# Altium project 2.0 - DSP_Expansion_Board_for_28379D_LAUNCHXL.PrjPcb
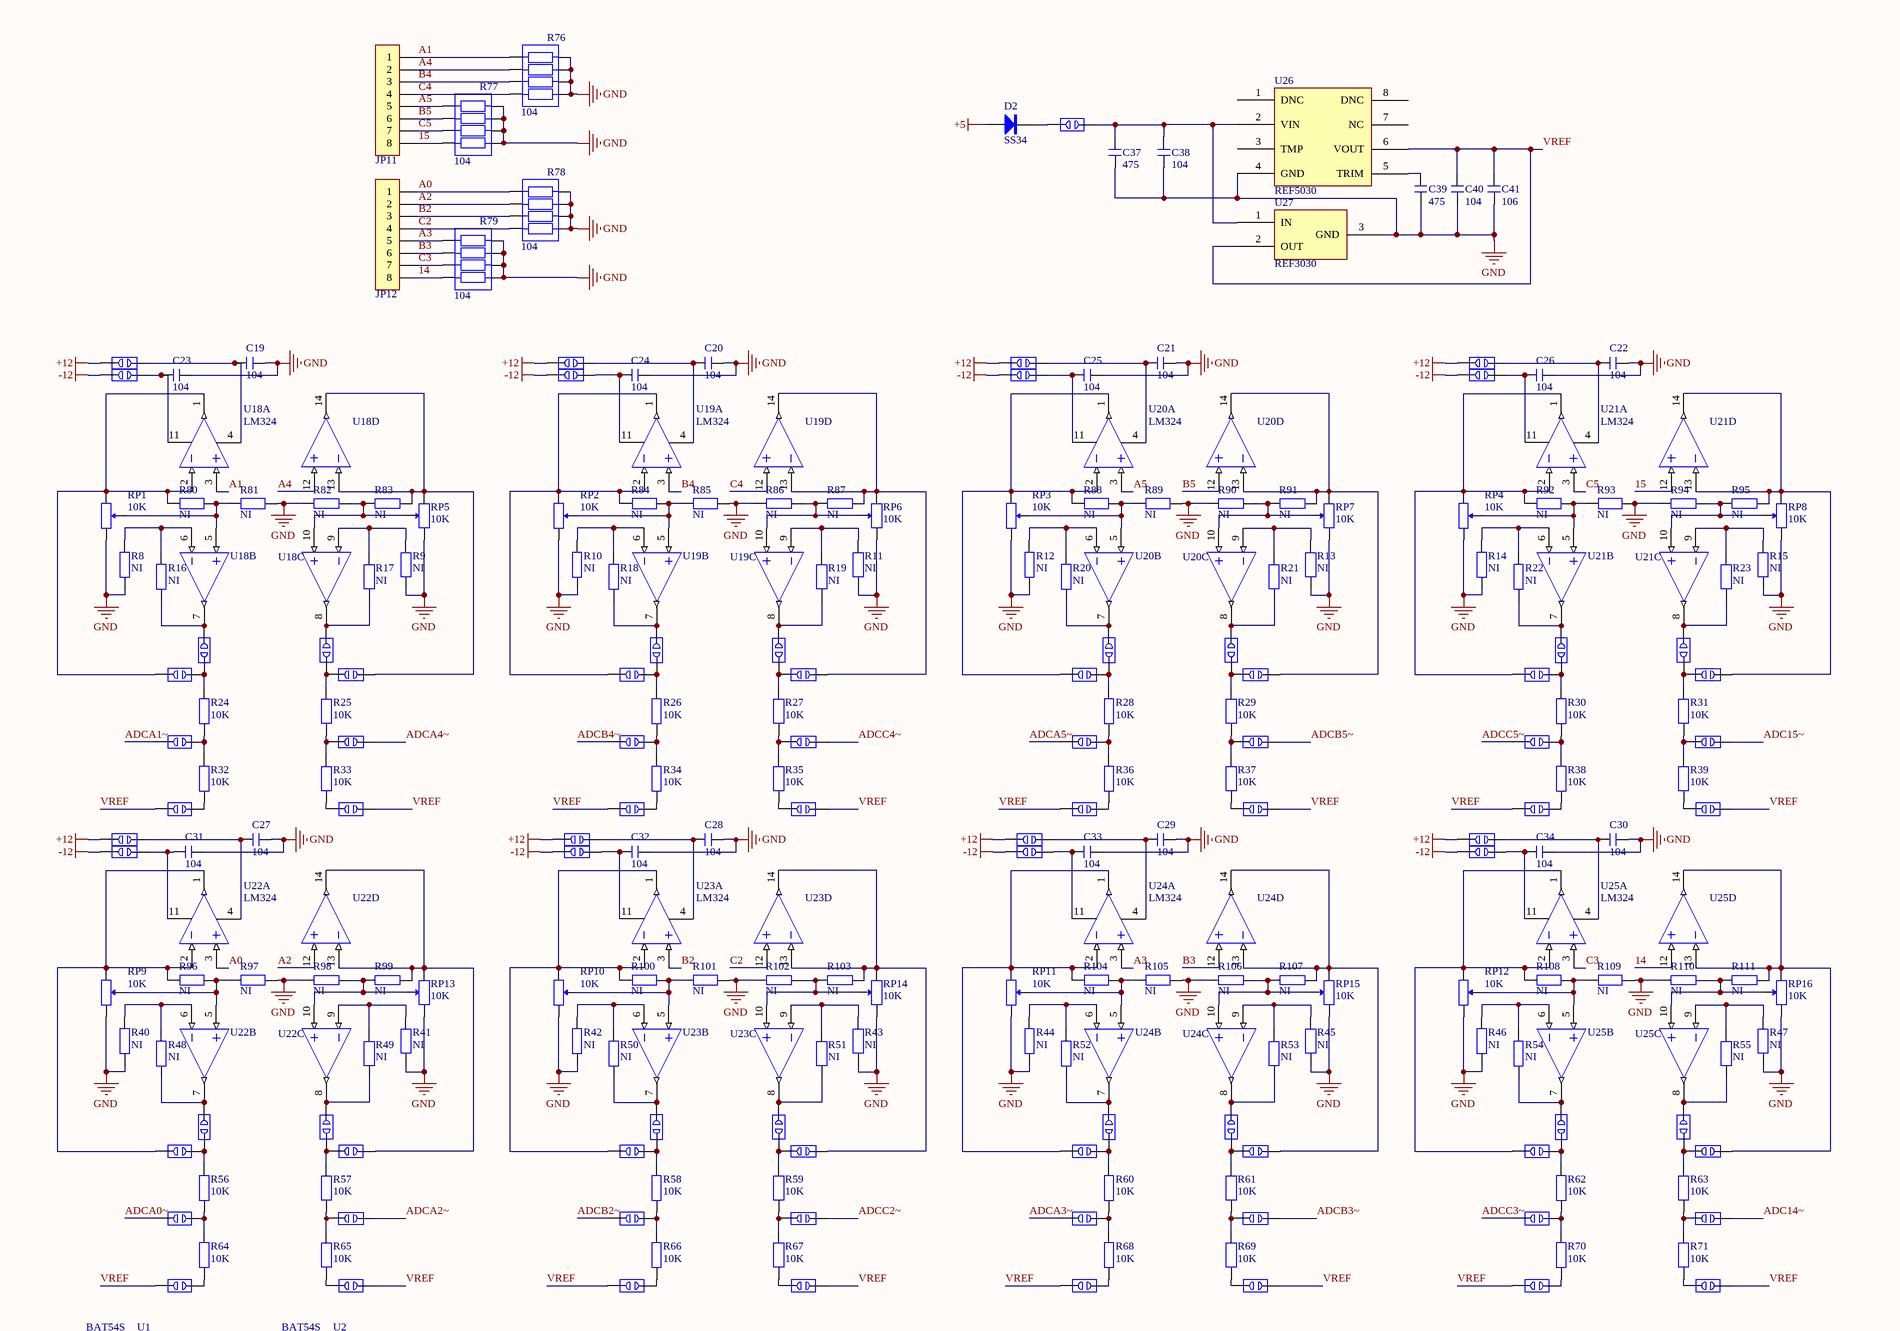
[diagram p0: DSP_Expansion_Board.SchDoc, top]
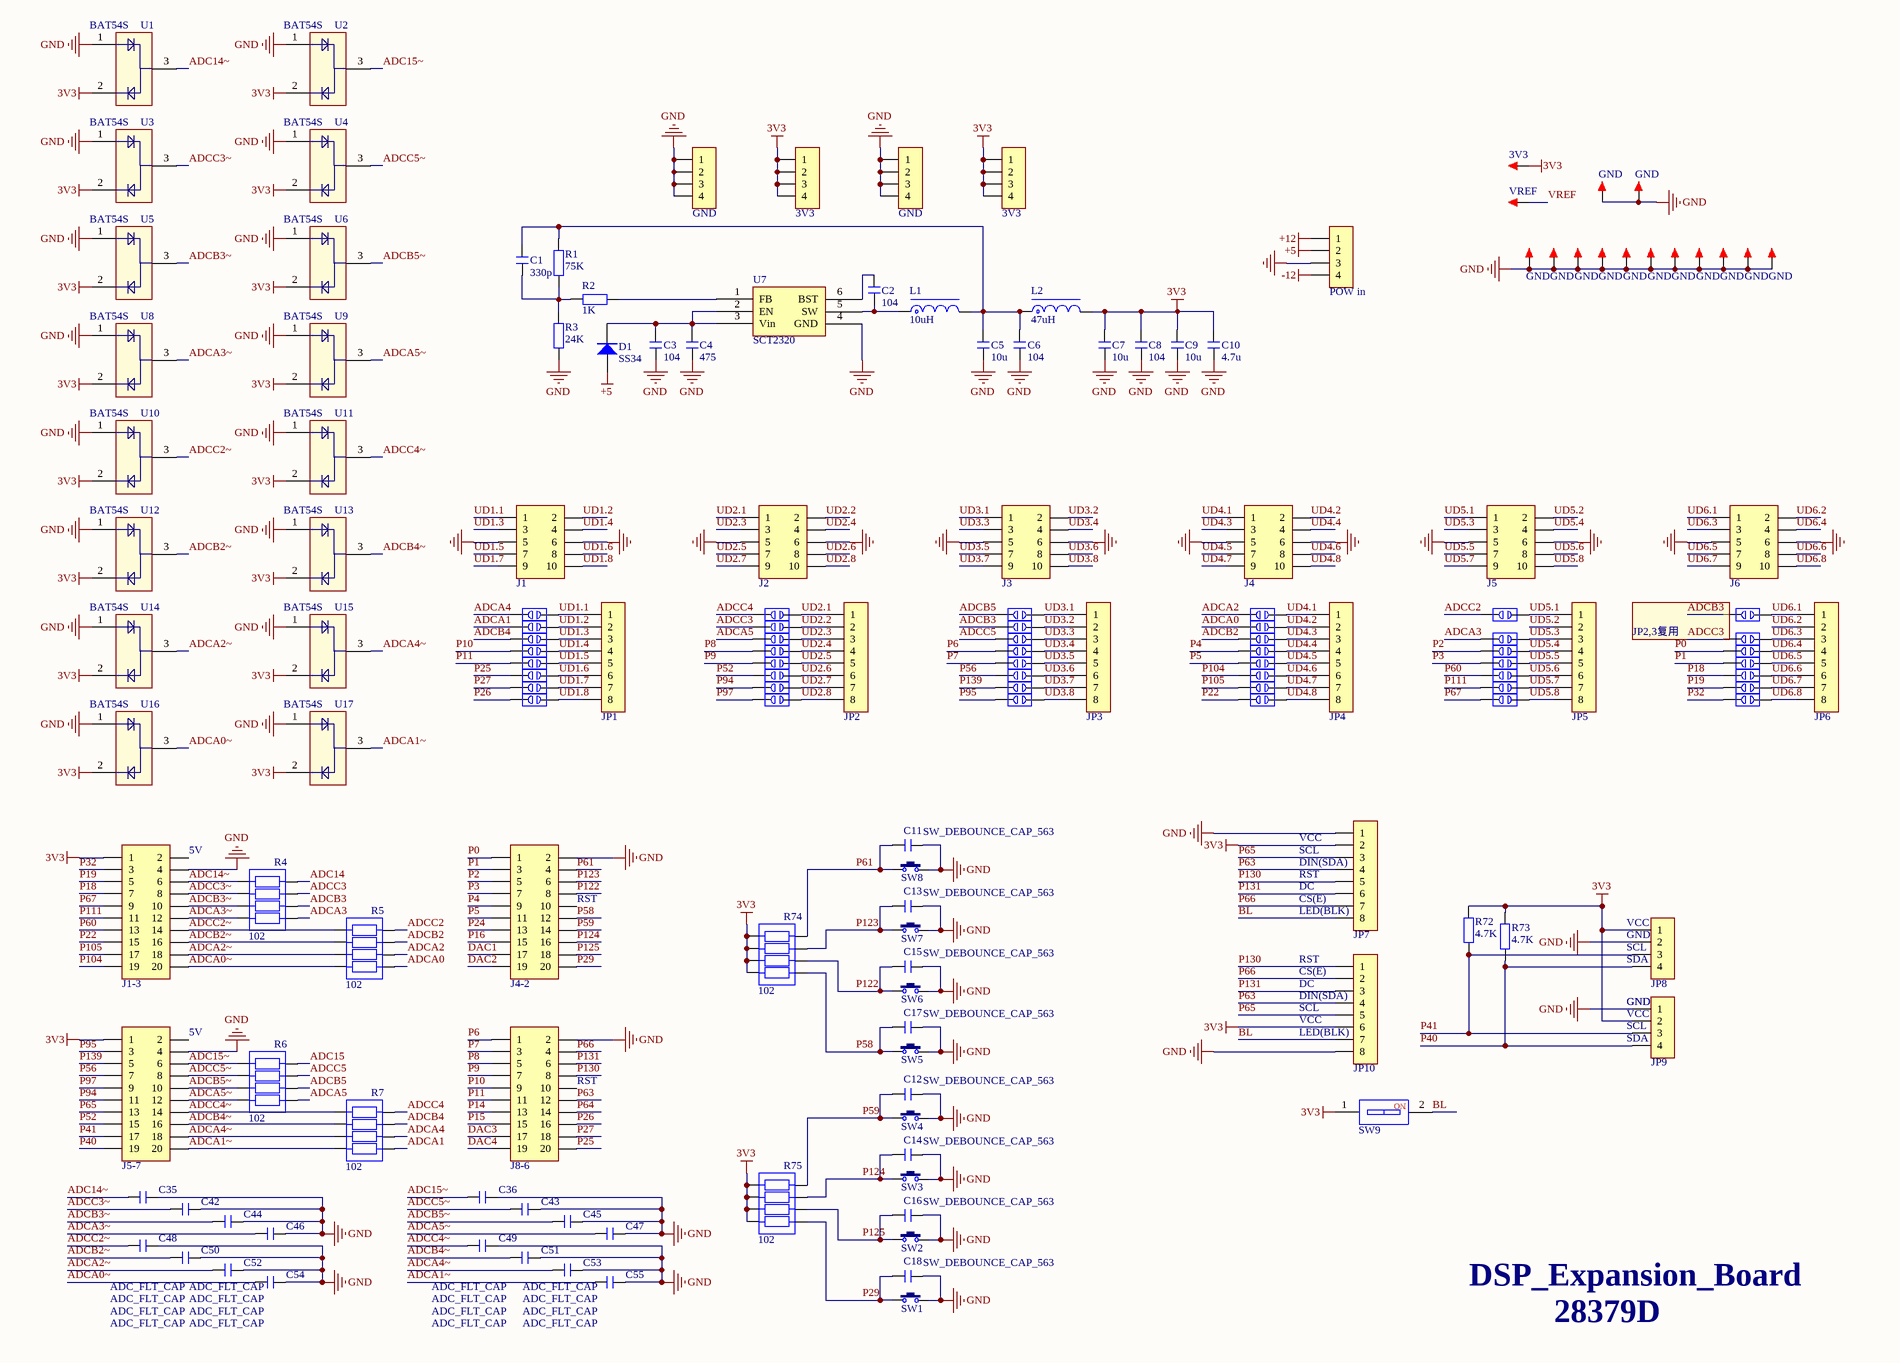
[diagram p1: DSP_Expansion_Board.SchDoc, bottom]
1 sheet, 391 parts. Net scope: global (net labels, ports and power ports of the same name join across sheets).
Board file: DSP_Expansion_Board.PcbDoc

## Sheet DSP_Expansion_Board.SchDoc
size A2 portrait; Organization: Altium Limited; Address1: L3, 12a Rodborough Rd; Address2: Frenchs Forest; Address3: NSW; Address4: Australia 2086

### Parts
(Parts that share a designator on the sheet are numbered #1, #2 ... from top to bottom, then left to right.)
3V3#1  HDR-1X4  [KF2510-LI-4P]  (value not drawn)
3V3#2  HDR-1X4  [KF2510-LI-4P]  (value not drawn)
3V3#3  TEST  [TEST 1.8]  (value not drawn)
C1  330p  [C 0805_L]
C2  104  [C 0805_L]
C3  104  [C 0805_L]
C4  475  [C 0805_L]
C5  10u  [C 1210_L]
C6  104  [C 0805_L]
C7  10u  [C 0805_L]
C8  104  [C 0805_L]
C9  10u  [C 1210_L]
C10  4.7u  [C 0805_L]
C11  SW_DEBOUNCE_CAP_563  [C 0603_L]
C12  SW_DEBOUNCE_CAP_563  [C 0603_L]
C13  SW_DEBOUNCE_CAP_563  [C 0603_L]
C14  SW_DEBOUNCE_CAP_563  [C 0603_L]
C15  SW_DEBOUNCE_CAP_563  [C 0603_L]
C16  SW_DEBOUNCE_CAP_563  [C 0603_L]
C17  SW_DEBOUNCE_CAP_563  [C 0603_L]
C18  SW_DEBOUNCE_CAP_563  [C 0603_L]
C19  104  [C 0805_L]
C20  104  [C 0805_L]
C21  104  [C 0805_L]
C22  104  [C 0805_L]
C23  104  [C 0805_L]
C24  104  [C 0805_L]
C25  104  [C 0805_L]
C26  104  [C 0805_L]
C27  104  [C 0805_L]
C28  104  [C 0805_L]
C29  104  [C 0805_L]
C30  104  [C 0805_L]
C31  104  [C 0805_L]
C32  104  [C 0805_L]
C33  104  [C 0805_L]
C34  104  [C 0805_L]
C35  ADC_FLT_CAP  [C 0805_L]
C36  ADC_FLT_CAP  [C 0805_L]
C37  475  [C 0805_L]
C38  104  [C 0805_L]
C39  475  [C 0805_L]
C40  104  [C 0805_L]
C41  106  [C 1210_L]
C42  ADC_FLT_CAP  [C 0805_L]
C43  ADC_FLT_CAP  [C 0805_L]
C44  ADC_FLT_CAP  [C 0805_L]
C45  ADC_FLT_CAP  [C 0805_L]
C46  ADC_FLT_CAP  [C 0805_L]
C47  ADC_FLT_CAP  [C 0805_L]
C48  ADC_FLT_CAP  [C 0805_L]
C49  ADC_FLT_CAP  [C 0805_L]
C50  ADC_FLT_CAP  [C 0805_L]
C51  ADC_FLT_CAP  [C 0805_L]
C52  ADC_FLT_CAP  [C 0805_L]
C53  ADC_FLT_CAP  [C 0805_L]
C54  ADC_FLT_CAP  [C 0805_L]
C55  ADC_FLT_CAP  [C 0805_L]
D1  SS34  [SMA]
D2  SS34  [SMA]
DE1  DEBUG PAD  [DEBUG_B]  (value not drawn)
DE2  DEBUG PAD  [DEBUG_B]  (value not drawn)
DE3  DEBUG PAD  [DEBUG_B]  (value not drawn)
DE4  DEBUG PAD  [DEBUG_B]  (value not drawn)
DE5  DEBUG PAD  [DEBUG_B]  (value not drawn)
DE6  DEBUG PAD  [DEBUG_B]  (value not drawn)
DE7  DEBUG PAD  [DEBUG_B]  (value not drawn)
DE8  DEBUG PAD  [DEBUG_B]  (value not drawn)
DE9  DEBUG PAD  [DEBUG_B]  (value not drawn)
DE10  DEBUG PAD  [DEBUG_B]  (value not drawn)
DE11  DEBUG PAD  [DEBUG_B]  (value not drawn)
DE12  DEBUG PAD  [DEBUG_B]  (value not drawn)
DE13  DEBUG PAD  [DEBUG_B]  (value not drawn)
DE14  DEBUG PAD  [DEBUG_B]  (value not drawn)
DE15  DEBUG PAD  [DEBUG_B]  (value not drawn)
DE16  DEBUG PAD  [DEBUG_B]  (value not drawn)
DE17  DEBUG PAD  [DEBUG_B]  (value not drawn)
DE18  DEBUG PAD  [DEBUG_B]  (value not drawn)
DE19  DEBUG PAD  [DEBUG_B]  (value not drawn)
DE20  DEBUG PAD  [DEBUG_B]  (value not drawn)
DE21  DEBUG PAD  [DEBUG_B]  (value not drawn)
DE22  DEBUG PAD  [DEBUG_B]  (value not drawn)
DE23  DEBUG PAD  [DEBUG_B]  (value not drawn)
DE24  DEBUG PAD  [DEBUG_B]  (value not drawn)
DE25  DEBUG PAD  [DEBUG_B]  (value not drawn)
DE26  DEBUG PAD  [DEBUG_B]  (value not drawn)
DE27  DEBUG PAD  [DEBUG_B]  (value not drawn)
DE28  DEBUG PAD  [DEBUG_B]  (value not drawn)
DE29  DEBUG PAD  [DEBUG_B]  (value not drawn)
DE30  DEBUG PAD  [DEBUG_B]  (value not drawn)
DE31  DEBUG PAD  [DEBUG_B]  (value not drawn)
DE32  DEBUG PAD  [DEBUG_B]  (value not drawn)
DE33  DEBUG PAD  [DEBUG_B]  (value not drawn)
DE34  DEBUG PAD  [DEBUG_B]  (value not drawn)
DE35  DEBUG PAD  [DEBUG_B]  (value not drawn)
DE36  DEBUG PAD  [DEBUG_B]  (value not drawn)
DE37  DEBUG PAD  [DEBUG_B]  (value not drawn)
DE38  DEBUG PAD  [DEBUG_B]  (value not drawn)
DE39  DEBUG PAD  [DEBUG_B]  (value not drawn)
DE40  DEBUG PAD  [DEBUG_B]  (value not drawn)
DE41  DEBUG PAD  [DEBUG_B]  (value not drawn)
DE42  DEBUG PAD  [DEBUG_B]  (value not drawn)
DE43  DEBUG PAD  [DEBUG_B]  (value not drawn)
DE44  DEBUG PAD  [DEBUG_B]  (value not drawn)
DE45  DEBUG PAD  [DEBUG_B]  (value not drawn)
DE46  DEBUG PAD  [DEBUG_B]  (value not drawn)
DE47  DEBUG PAD  [DEBUG_B]  (value not drawn)
DE48  DEBUG PAD  [DEBUG_B]  (value not drawn)
DE49  DEBUG PAD  [DEBUG_B]  (value not drawn)
DE50  DEBUG PAD  [DEBUG_B]  (value not drawn)
DE51  DEBUG PAD  [DEBUG_B]  (value not drawn)
DE52  DEBUG PAD  [DEBUG_B]  (value not drawn)
DE53  DEBUG PAD  [DEBUG_B]  (value not drawn)
DE54  DEBUG PAD  [DEBUG_B]  (value not drawn)
DE55  DEBUG PAD  [DEBUG_B]  (value not drawn)
DE56  DEBUG PAD  [DEBUG_B]  (value not drawn)
DE57  DEBUG PAD  [DEBUG_B]  (value not drawn)
DE58  DEBUG PAD  [DEBUG_B]  (value not drawn)
DE59  DEBUG PAD  [DEBUG_B]  (value not drawn)
DE60  DEBUG PAD  [DEBUG_B]  (value not drawn)
DE61  DEBUG PAD  [DEBUG_B]  (value not drawn)
DE62  DEBUG PAD  [DEBUG_B]  (value not drawn)
DE63  DEBUG PAD  [DEBUG_B]  (value not drawn)
DE64  DEBUG PAD  [DEBUG_B]  (value not drawn)
DE65  DEBUG PAD  [DEBUG_B]  (value not drawn)
DE66  DEBUG PAD  [DEBUG_B]  (value not drawn)
DE67  DEBUG PAD  [DEBUG_B]  (value not drawn)
DE68  DEBUG PAD  [DEBUG_B]  (value not drawn)
DE69  DEBUG PAD  [DEBUG_B]  (value not drawn)
DE70  DEBUG PAD  [DEBUG_B]  (value not drawn)
DE71  DEBUG PAD  [DEBUG_B]  (value not drawn)
DE72  DEBUG PAD  [DEBUG_B]  (value not drawn)
DE73  DEBUG PAD  [DEBUG_B]  (value not drawn)
DE74  DEBUG PAD  [DEBUG_B]  (value not drawn)
DE75  DEBUG PAD  [DEBUG_B]  (value not drawn)
DE76  DEBUG PAD  [DEBUG_B]  (value not drawn)
DE77  DEBUG PAD  [DEBUG_B]  (value not drawn)
DE78  DEBUG PAD  [DEBUG_B]  (value not drawn)
DE79  DEBUG PAD  [DEBUG_B]  (value not drawn)
DE80  DEBUG PAD  [DEBUG_B]  (value not drawn)
DE81  DEBUG PAD  [DEBUG_B]  (value not drawn)
DE82  DEBUG PAD  [DEBUG_B]  (value not drawn)
DE83  DEBUG PAD  [DEBUG_B]  (value not drawn)
DE84  DEBUG PAD  [DEBUG_B]  (value not drawn)
DE85  DEBUG PAD  [DEBUG_B]  (value not drawn)
DE86  DEBUG PAD  [DEBUG_B]  (value not drawn)
DE87  DEBUG PAD  [DEBUG_B]  (value not drawn)
DE88  DEBUG PAD  [DEBUG_B]  (value not drawn)
DE89  DEBUG PAD  [DEBUG_B]  (value not drawn)
DE90  DEBUG PAD  [DEBUG_B]  (value not drawn)
DE91  DEBUG PAD  [DEBUG_B]  (value not drawn)
DE92  DEBUG PAD  [DEBUG_B]  (value not drawn)
DE93  DEBUG PAD  [DEBUG_B]  (value not drawn)
DE94  DEBUG PAD  [DEBUG_B]  (value not drawn)
DE95  DEBUG PAD  [DEBUG_B]  (value not drawn)
DE96  DEBUG PAD  [DEBUG_B]  (value not drawn)
DE97  DEBUG PAD  [DEBUG_B]  (value not drawn)
DE98  DEBUG PAD  [DEBUG_B]  (value not drawn)
DE99  DEBUG PAD  [DEBUG_B]  (value not drawn)
DE100  DEBUG PAD  [DEBUG_B]  (value not drawn)
DE101  DEBUG PAD  [DEBUG_B]  (value not drawn)
DE102  DEBUG PAD  [DEBUG_B]  (value not drawn)
DE103  DEBUG PAD  [DEBUG_B]  (value not drawn)
DE104  DEBUG PAD  [DEBUG_B]  (value not drawn)
DE105  DEBUG PAD  [DEBUG_B]  (value not drawn)
DE106  DEBUG PAD  [DEBUG_B]  (value not drawn)
DE107  DEBUG PAD  [DEBUG_B]  (value not drawn)
DE108  DEBUG PAD  [DEBUG_B]  (value not drawn)
DE109  DEBUG PAD  [DEBUG_B]  (value not drawn)
DE110  DEBUG PAD  [DEBUG_B]  (value not drawn)
DE111  DEBUG PAD  [DEBUG_B]  (value not drawn)
DE112  DEBUG PAD  [DEBUG_B]  (value not drawn)
DE113  DEBUG PAD  [DEBUG_B]  (value not drawn)
DE114  DEBUG PAD  [DEBUG_B]  (value not drawn)
DE115  DEBUG PAD  [DEBUG_B]  (value not drawn)
DE116  DEBUG PAD  [DEBUG_B]  (value not drawn)
DE117  DEBUG PAD  [DEBUG_B]  (value not drawn)
DE118  DEBUG PAD  [DEBUG_B]  (value not drawn)
DE119  DEBUG PAD  [DEBUG_B]  (value not drawn)
DE120  DEBUG PAD  [DEBUG_B]  (value not drawn)
DE121  DEBUG PAD  [DEBUG_B]  (value not drawn)
DE122  DEBUG PAD  [DEBUG_B]  (value not drawn)
DE123  DEBUG PAD  [DEBUG_B]  (value not drawn)
DE124  DEBUG PAD  [DEBUG_B]  (value not drawn)
DE125  DEBUG PAD  [DEBUG_B]  (value not drawn)
DE126  DEBUG PAD  [DEBUG_B]  (value not drawn)
DE127  DEBUG PAD  [DEBUG_B]  (value not drawn)
GND#1  HDR-1X4  [KF2510-LI-4P]  (value not drawn)
GND#2  HDR-1X4  [KF2510-LI-4P]  (value not drawn)
GND#3  TEST  [TEST 1.8]  (value not drawn)
GND#4  TEST  [TEST 1.8]  (value not drawn)
GND#5  TEST TP  [TEST TP1.4_B]  (value not drawn)
GND#6  TEST TP  [TEST TP1.4_B]  (value not drawn)
GND#7  TEST TP  [TEST TP1.4_B]  (value not drawn)
GND#8  TEST TP  [TEST TP1.4_B]  (value not drawn)
GND#9  TEST TP  [TEST TP1.4_B]  (value not drawn)
GND#10  TEST TP  [TEST TP1.4_B]  (value not drawn)
GND#11  TEST TP  [TEST TP1.4_B]  (value not drawn)
GND#12  TEST TP  [TEST TP1.4_B]  (value not drawn)
GND#13  TEST TP  [TEST TP1.4_B]  (value not drawn)
GND#14  TEST TP  [TEST TP1.4_B]  (value not drawn)
GND#15  TEST TP  [TEST TP1.4_B]  (value not drawn)
J1  Header 5X2  [IDC2.54-LI-2x5P]  (value not drawn)
J1-3  Header 2X10  [HDR2.54-LI-2x10P]  (value not drawn)
J2  Header 5X2  [IDC2.54-LI-2x5P]  (value not drawn)
J3  Header 5X2  [IDC2.54-LI-2x5P]  (value not drawn)
J4  Header 5X2  [IDC2.54-LI-2x5P]  (value not drawn)
J4-2  Header 2X10  [HDR2.54-LI-2x10P]  (value not drawn)
J5  Header 5X2  [IDC2.54-LI-2x5P]  (value not drawn)
J5-7  Header 2X10  [HDR2.54-LI-2x10P]  (value not drawn)
J6  Header 5X2  [IDC2.54-LI-2x5P]  (value not drawn)
J8-6  Header 2X10  [HDR2.54-LI-2x10P]  (value not drawn)
JP1  HDR-1X8  [KF2510-LI-8P]  (value not drawn)
JP2  HDR-1X8  [KF2510-LI-8P]  (value not drawn)
JP3  HDR-1X8  [KF2510-LI-8P]  (value not drawn)
JP4  HDR-1X8  [KF2510-LI-8P]  (value not drawn)
JP5  HDR-1X8  [KF2510-LI-8P]  (value not drawn)
JP6  HDR-1X8  [KF2510-LI-8P]  (value not drawn)
JP7  HDR-1X8  [HDR2.54-M-LI-8P]  (value not drawn)
JP8  HDR-1X4  [HDR2.54-M-LI-4P]  (value not drawn)
JP9  HDR-1X4  [HDR2.54-M-LI-4P]  (value not drawn)
JP10  HDR-1X8  [HDR2.54-M-LI-8P]  (value not drawn)
JP11  HDR-1X8  [KF2510-LI-8P]  (value not drawn)
JP12  HDR-1X8  [KF2510-LI-8P]  (value not drawn)
L1  10uH  [CDRH74]
L2  47uH  [CDRH74]
POW_in  HDR-1X4  [KF2510-LI-4P]  (value not drawn)
R1  75K  [R 0805_L]
R2  1K  [R 0805_L]
R3  24K  [R 0805_L]
R4  102  [RCA-8P4R-0603]
R5  102  [RCA-8P4R-0603]
R6  102  [RCA-8P4R-0603]
R7  102  [RCA-8P4R-0603]
R8  NI  [R 0805_L]
R9  NI  [R 0805_L]
R10  NI  [R 0805_L]
R11  NI  [R 0805_L]
R12  NI  [R 0805_L]
R13  NI  [R 0805_L]
R14  NI  [R 0805_L]
R15  NI  [R 0805_L]
R16  NI  [R 0805_L]
R17  NI  [R 0805_L]
R18  NI  [R 0805_L]
R19  NI  [R 0805_L]
R20  NI  [R 0805_L]
R21  NI  [R 0805_L]
R22  NI  [R 0805_L]
R23  NI  [R 0805_L]
R24  10K  [R 0805_L]
R25  10K  [R 0805_L]
R26  10K  [R 0805_L]
R27  10K  [R 0805_L]
R28  10K  [R 0805_L]
R29  10K  [R 0805_L]
R30  10K  [R 0805_L]
R31  10K  [R 0805_L]
R32  10K  [R 0805_L]
R33  10K  [R 0805_L]
R34  10K  [R 0805_L]
R35  10K  [R 0805_L]
R36  10K  [R 0805_L]
R37  10K  [R 0805_L]
R38  10K  [R 0805_L]
R39  10K  [R 0805_L]
R40  NI  [R 0805_L]
R41  NI  [R 0805_L]
R42  NI  [R 0805_L]
R43  NI  [R 0805_L]
R44  NI  [R 0805_L]
R45  NI  [R 0805_L]
R46  NI  [R 0805_L]
R47  NI  [R 0805_L]
R48  NI  [R 0805_L]
R49  NI  [R 0805_L]
R50  NI  [R 0805_L]
R51  NI  [R 0805_L]
R52  NI  [R 0805_L]
R53  NI  [R 0805_L]
R54  NI  [R 0805_L]
R55  NI  [R 0805_L]
R56  10K  [R 0805_L]
R57  10K  [R 0805_L]
R58  10K  [R 0805_L]
R59  10K  [R 0805_L]
R60  10K  [R 0805_L]
R61  10K  [R 0805_L]
R62  10K  [R 0805_L]
R63  10K  [R 0805_L]
R64  10K  [R 0805_L]
R65  10K  [R 0805_L]
R66  10K  [R 0805_L]
R67  10K  [R 0805_L]
R68  10K  [R 0805_L]
R69  10K  [R 0805_L]
R70  10K  [R 0805_L]
R71  10K  [R 0805_L]
R72  4.7K  [R 0805_L]
R73  4.7K  [R 0805_L]
R74  102  [RCA-8P4R-0603]
R75  102  [RCA-8P4R-0603]
R76  104  [RCA-8P4R-0603]
R77  104  [RCA-8P4R-0603]
R78  104  [RCA-8P4R-0603]
R79  104  [RCA-8P4R-0603]
R80  NI  [R 0805_L]
R81  NI  [R 0805_L]
R82  NI  [R 0805_L]
R83  NI  [R 0805_L]
R84  NI  [R 0805_L]
R85  NI  [R 0805_L]
R86  NI  [R 0805_L]
R87  NI  [R 0805_L]
R88  NI  [R 0805_L]
R89  NI  [R 0805_L]
R90  NI  [R 0805_L]
R91  NI  [R 0805_L]
R92  NI  [R 0805_L]
R93  NI  [R 0805_L]
R94  NI  [R 0805_L]
R95  NI  [R 0805_L]
R96  NI  [R 0805_L]
R97  NI  [R 0805_L]
R98  NI  [R 0805_L]
R99  NI  [R 0805_L]
R100  NI  [R 0805_L]
R101  NI  [R 0805_L]
R102  NI  [R 0805_L]
R103  NI  [R 0805_L]
R104  NI  [R 0805_L]
R105  NI  [R 0805_L]
R106  NI  [R 0805_L]
R107  NI  [R 0805_L]
R108  NI  [R 0805_L]
R109  NI  [R 0805_L]
R110  NI  [R 0805_L]
R111  NI  [R 0805_L]
RP1  10K  [3303W]
RP2  10K  [3303W]
RP3  10K  [3303W]
RP4  10K  [3303W]
RP5  10K  [3303W]
RP6  10K  [3303W]
RP7  10K  [3303W]
RP8  10K  [3303W]
RP9  10K  [3303W]
RP10  10K  [3303W]
RP11  10K  [3303W]
RP12  10K  [3303W]
RP13  10K  [3303W]
RP14  10K  [3303W]
RP15  10K  [3303W]
RP16  10K  [3303W]
SW1  3x6x5  [TSW SMD-3*6*4.3]  (value not drawn)
SW2  3x6x5  [TSW SMD-3*6*4.3]  (value not drawn)
SW3  3x6x5  [TSW SMD-3*6*4.3]  (value not drawn)
SW4  3x6x5  [TSW SMD-3*6*4.3]  (value not drawn)
SW5  3x6x5  [TSW SMD-3*6*4.3]  (value not drawn)
SW6  3x6x5  [TSW SMD-3*6*4.3]  (value not drawn)
SW7  3x6x5  [TSW SMD-3*6*4.3]  (value not drawn)
SW8  3x6x5  [TSW SMD-3*6*4.3]  (value not drawn)
SW9  SW-1P  [CSW DIP-1P]  (value not drawn)
U1  BAT54S  [SOT23-3L]
U2  BAT54S  [SOT23-3L]
U3  BAT54S  [SOT23-3L]
U4  BAT54S  [SOT23-3L]
U5  BAT54S  [SOT23-3L]
U6  BAT54S  [SOT23-3L]
U7  SCT2320  [SOT23-6]
U8  BAT54S  [SOT23-3L]
U9  BAT54S  [SOT23-3L]
U10  BAT54S  [SOT23-3L]
U11  BAT54S  [SOT23-3L]
U12  BAT54S  [SOT23-3L]
U13  BAT54S  [SOT23-3L]
U14  BAT54S  [SOT23-3L]
U15  BAT54S  [SOT23-3L]
U16  BAT54S  [SOT23-3L]
U17  BAT54S  [SOT23-3L]
U18  LM324  [SOIC-14]  (parts A,B,C,D of 4)
U19  LM324  [SOIC-14]  (parts A,B,C,D of 4)
U20  LM324  [SOIC-14]  (parts A,B,C,D of 4)
U21  LM324  [SOIC-14]  (parts A,B,C,D of 4)
U22  LM324  [SOIC-14]  (parts A,B,C,D of 4)
U23  LM324  [SOIC-14]  (parts A,B,C,D of 4)
U24  LM324  [SOIC-14]  (parts A,B,C,D of 4)
U25  LM324  [SOIC-14]  (parts A,B,C,D of 4)
U26  REF5030  [SOP8_N]
U27  REF3030  [SOT23-3L]
VREF  TEST  [TEST 1.8]  (value not drawn)

### Nets
3V3: 3V3#1.1 3V3#1.2 3V3#1.3 3V3#1.4 3V3#2.1 3V3#2.2 3V3#2.3 3V3#2.4 3V3#3.1 C7.2 C8.2 C9.2 C10.2 J1-3.1 J5-7.1 JP7.2 JP8.1 JP9.2 JP10.6 L2.2 R72.2 R73.2 R74.1 R74.2 R74.3 R74.4 R75.1 R75.2 R75.3 R75.4 SW9.1 U1.2 U2.2 U3.2 U4.2 U5.2 U6.2 U8.2 U9.2 U10.2 U11.2 U12.2 U13.2 U14.2 U15.2 U16.2 U17.2
+5: D1.1(A) D2.1(A) POW_in.2
+12: DE82.2 DE98.2 DE99.2 DE100.2 DE105.2 DE106.2 DE107.2 DE108.2 POW_in.1
-12: DE101.2 DE102.2 DE103.2 DE104.2 DE109.2 DE110.2 DE111.2 DE112.2 POW_in.4
GND: C3.1 C4.1 C5.1 C6.1 C7.1 C8.1 C9.1 C10.1 C11.2 C12.2 C13.2 C14.2 C15.2 C16.2 C17.2 C18.2 C19.1 C20.1 C21.1 C22.1 C23.1 C24.1 C25.1 C26.1 C27.1 C28.1 C29.1 C30.1 C31.1 C32.1 C33.1 C34.1 C35.1 C36.1 C37.1 C38.1 C39.1 C40.1 C41.1 C42.1 C43.1 C44.1 C45.1 C46.1 C47.1 C48.1 C49.1 C50.1 C51.1 C52.1 C53.1 C54.1 C55.1 GND#1.1 GND#1.2 GND#1.3 GND#1.4 GND#2.1 GND#2.2 GND#2.3 GND#2.4 GND#3.1 GND#4.1 GND#5.1 GND#6.1 GND#7.1 GND#8.1 GND#9.1 GND#10.1 GND#11.1 GND#12.1 GND#13.1 GND#14.1 GND#15.1 J1.5 J1.6 J1-3.4 J2.5 J2.6 J3.5 J3.6 J4.5 J4.6 J4-2.2 J5.5 J5.6 J5-7.4 J6.5 J6.6 J8-6.2 JP7.1 JP8.2 JP9.1 JP10.8 POW_in.3 R3.1 R8.2 R9.2 R10.2 R11.2 R12.2 R13.2 R14.2 R15.2 R40.2 R41.2 R42.2 R43.2 R44.2 R45.2 R46.2 R47.2 R76.5 R76.6 R76.7 R76.8 R77.5 R77.6 R77.7 R77.8 R78.5 R78.6 R78.7 R78.8 R79.5 R79.6 R79.7 R79.8 R81.1 R82.1 R85.1 R86.1 R89.1 R90.1 R93.1 R94.1 R97.1 R98.1 R101.1 R102.1 R105.1 R106.1 R109.1 R110.1 RP1.3 RP2.3 RP3.3 RP4.3 RP5.3 RP6.3 RP7.3 RP8.3 RP9.3 RP10.3 RP11.3 RP12.3 RP13.3 RP14.3 RP15.3 RP16.3 SW1.2 SW2.2 SW3.2 SW4.2 SW5.2 SW6.2 SW7.2 SW8.2 U1.1 U2.1 U3.1 U4.1 U5.1 U6.1 U7.4(GND) U8.1 U9.1 U10.1 U11.1 U12.1 U13.1 U14.1 U15.1 U16.1 U17.1 U26.4(GND) U27.3(GND)
14: JP12.8 R79.4 U25.12(IN+)
15: JP11.8 R77.4 U21.12(IN+)
A0: JP12.1 R78.1 U22.3(IN+)
A1: JP11.1 R76.1 U18.3(IN+)
A2: JP12.2 R78.2 U22.12(IN+)
A3: JP12.5 R79.1 U24.3(IN+)
A4: JP11.2 R76.2 U18.12(IN+)
A5: JP11.5 R77.1 U20.3(IN+)
ADC14: R4.8
ADC14~: C35.2 DE96.1 J1-3.6 R4.1 U1.3
ADC15: R6.8
ADC15~: C36.2 DE72.1 J5-7.6 R6.1 U2.3
ADCA0: DE10.1 R5.5
ADCA0~: C54.2 DE89.1 J1-3.20 R5.4 U16.3
ADCA1: DE7.1 R7.5
ADCA1~: C55.2 DE65.1 J5-7.20 R7.4 U17.3
ADCA2: DE4.1 R5.6
ADCA2~: C52.2 DE90.1 J1-3.18 R5.3 U14.3
ADCA3: DE17.1 R4.5
ADCA3~: C46.2 DE93.1 J1-3.12 R4.4 U8.3
ADCA4: DE1.1 R7.6
ADCA4~: C53.2 DE66.1 J5-7.18 R7.3 U15.3
ADCA5: DE14.1 R6.5
ADCA5~: C47.2 DE69.1 J5-7.12 R6.4 U9.3
ADCB2: DE16.1 R5.7
ADCB2~: C50.2 DE91.1 J1-3.16 R5.2 U12.3
ADCB3: DE6.1 DE9.1 R4.6
ADCB3~: C44.2 DE94.1 J1-3.10 R4.3 U5.3
ADCB4: DE13.1 R7.7
ADCB4~: C51.2 DE67.1 J5-7.16 R7.2 U13.3
ADCB5: DE3.1 R6.6
ADCB5~: C45.2 DE70.1 J5-7.10 R6.3 U6.3
ADCC2: DE5.1 R5.8
ADCC2~: C48.2 DE92.1 J1-3.14 R5.1 U10.3
ADCC3: DE8.1 DE18.1 R4.7
ADCC3~: C42.2 DE95.1 J1-3.8 R4.2 U3.3
ADCC4: DE2.1 R7.8
ADCC4~: C49.2 DE68.1 J5-7.14 R7.1 U11.3
ADCC5: DE15.1 R6.7
ADCC5~: C43.2 DE71.1 J5-7.8 R6.2 U4.3
B2: JP12.3 R78.3 U23.3(IN+)
B3: JP12.6 R79.2 U24.12(IN+)
B4: JP11.3 R76.3 U19.3(IN+)
B5: JP11.6 R77.2 U20.12(IN+)
BL: JP7.8 JP10.7 SW9.2
C2: JP12.4 R78.4 U23.12(IN+)
C3: JP12.7 R79.3 U25.3(IN+)
C4: JP11.4 R76.4 U19.12(IN+)
C5: JP11.7 R77.3 U21.3(IN+)
DAC1: J4-2.17
DAC2: J4-2.19
DAC3: J8-6.17
DAC4: J8-6.19
P0: DE24.1 J4-2.1
P1: DE30.1 J4-2.3
P2: DE23.1 J4-2.5
P3: DE29.1 J4-2.7
P4: DE22.1 J4-2.9
P5: DE28.1 J4-2.11
P6: DE21.1 J8-6.1
P7: DE27.1 J8-6.3
P8: DE20.1 J8-6.5
P9: DE26.1 J8-6.7
P10: DE19.1 J8-6.9
P11: DE25.1 J8-6.11
P14: J8-6.13
P15: J8-6.15
P16: J4-2.15
P18: DE36.1 J1-3.7
P19: DE42.1 J1-3.5
P22: DE46.1 J1-3.15
P24: J4-2.13
P25: DE31.1 J8-6.20
P26: DE43.1 J8-6.16
P27: DE37.1 J8-6.18
P29: C18.1 J4-2.20 R75.5 SW1.1
P32: DE48.1 J1-3.3
P40: J5-7.19 JP8.4 JP9.4 R73.1
P41: J5-7.17 JP8.3 JP9.3 R72.1
P52: DE32.1 J5-7.15
P56: DE33.1 J5-7.7
P58: C17.1 J4-2.12 R74.5 SW5.1
P59: C12.1 J4-2.14 R75.8 SW4.1
P60: DE35.1 J1-3.13
P61: C11.1 J4-2.4 R74.8 SW8.1
P63: J8-6.12 JP7.4 JP10.4
P64: J8-6.14
P65: J5-7.13 JP7.3 JP10.5
P66: J8-6.4 JP7.7 JP10.2
P67: DE47.1 J1-3.9
P94: DE38.1 J5-7.11
P95: DE45.1 J5-7.3
P97: DE44.1 J5-7.9
P104: DE34.1 J1-3.19
P105: DE40.1 J1-3.17
P111: DE41.1 J1-3.11
P122: C15.1 J4-2.8 R74.6 SW6.1
P123: C13.1 J4-2.6 R74.7 SW7.1
P124: C14.1 J4-2.16 R75.7 SW3.1
P125: C16.1 J4-2.18 R75.6 SW2.1
P130: J8-6.8 JP7.5 JP10.1
P131: J8-6.6 JP7.6 JP10.3
P139: DE39.1 J5-7.5
UD1.1: DE1.2 J1.1 JP1.1
UD1.2: DE7.2 J1.2 JP1.2
UD1.3: DE13.2 J1.3 JP1.3
UD1.4: DE19.2 J1.4 JP1.4
UD1.5: DE25.2 J1.7 JP1.5
UD1.6: DE31.2 J1.8 JP1.6
UD1.7: DE37.2 J1.9 JP1.7
UD1.8: DE43.2 J1.10 JP1.8
UD2.1: DE2.2 J2.1 JP2.1
UD2.2: DE8.2 J2.2 JP2.2
UD2.3: DE14.2 J2.3 JP2.3
UD2.4: DE20.2 J2.4 JP2.4
UD2.5: DE26.2 J2.7 JP2.5
UD2.6: DE32.2 J2.8 JP2.6
UD2.7: DE38.2 J2.9 JP2.7
UD2.8: DE44.2 J2.10 JP2.8
UD3.1: DE3.2 J3.1 JP3.1
UD3.2: DE9.2 J3.2 JP3.2
UD3.3: DE15.2 J3.3 JP3.3
UD3.4: DE21.2 J3.4 JP3.4
UD3.5: DE27.2 J3.7 JP3.5
UD3.6: DE33.2 J3.8 JP3.6
UD3.7: DE39.2 J3.9 JP3.7
UD3.8: DE45.2 J3.10 JP3.8
UD4.1: DE4.2 J4.1 JP4.1
UD4.2: DE10.2 J4.2 JP4.2
UD4.3: DE16.2 J4.3 JP4.3
UD4.4: DE22.2 J4.4 JP4.4
UD4.5: DE28.2 J4.7 JP4.5
UD4.6: DE34.2 J4.8 JP4.6
UD4.7: DE40.2 J4.9 JP4.7
UD4.8: DE46.2 J4.10 JP4.8
UD5.1: DE5.2 J5.1 JP5.1
UD5.2: J5.2 JP5.2
UD5.3: DE17.2 J5.3 JP5.3
UD5.4: DE23.2 J5.4 JP5.4
UD5.5: DE29.2 J5.7 JP5.5
UD5.6: DE35.2 J5.8 JP5.6
UD5.7: DE41.2 J5.9 JP5.7
UD5.8: DE47.2 J5.10 JP5.8
UD6.1: DE6.2 J6.1 JP6.1
UD6.2: J6.2 JP6.2
UD6.3: DE18.2 J6.3 JP6.3
UD6.4: DE24.2 J6.4 JP6.4
UD6.5: DE30.2 J6.7 JP6.5
UD6.6: DE36.2 J6.8 JP6.6
UD6.7: DE42.2 J6.9 JP6.7
UD6.8: DE48.2 J6.10 JP6.8
VREF: C40.2 C41.2 DE11.1 DE12.2 DE114.1 DE115.2 DE116.1 DE117.2 DE118.1 DE119.2 DE120.1 DE121.2 DE122.1 DE123.2 DE124.1 DE125.2 DE126.1 DE127.2 U26.6(VOUT) U27.2(OUT) VREF.1
NetC1_1: C1.1 R1.1 R2.2 R3.2
NetC1_2: C1.2 C5.2 C6.2 L1.2 L2.1 R1.2
NetC2_1: C2.1 U7.6(BST)
NetC2_2: C2.2 L1.1 U7.5(SW)
NetC3_2: C3.2 C4.2 D1.2(K) U7.2(EN) U7.3(Vin)
NetC19_2: C19.2 DE82.1 U18.4(V+)
NetC20_2: C20.2 DE98.1 U19.4(V+)
NetC21_2: C21.2 DE99.1 U20.4(V+)
NetC22_2: C22.2 DE100.1 U21.4(V+)
NetC23_2: C23.2 DE101.1 U18.11(V-)
NetC24_2: C24.2 DE102.1 U19.11(V-)
NetC25_2: C25.2 DE103.1 U20.11(V-)
NetC26_2: C26.2 DE104.1 U21.11(V-)
NetC27_2: C27.2 DE105.1 U22.4(V+)
NetC28_2: C28.2 DE106.1 U23.4(V+)
NetC29_2: C29.2 DE107.1 U24.4(V+)
NetC30_2: C30.2 DE108.1 U25.4(V+)
NetC31_2: C31.2 DE109.1 U22.11(V-)
NetC32_2: C32.2 DE110.1 U23.11(V-)
NetC33_2: C33.2 DE111.1 U24.11(V-)
NetC34_2: C34.2 DE112.1 U25.11(V-)
NetC37_2: C37.2 C38.2 DE97.2 U26.2(VIN) U27.1(IN)
NetC39_2: C39.2 U26.5(TRIM)
NetD2_2: D2.2(K) DE97.1
NetDE11_2: DE11.2 R32.2
NetDE12_1: DE12.1 R33.2
NetDE49_1: DE49.1 DE57.2 R24.1
NetDE49_2: DE49.2 R16.2 U18.7(OUT)
NetDE50_1: DE50.1 DE58.2 R25.1
NetDE50_2: DE50.2 R17.2 U18.8(OUT)
NetDE51_1: DE51.1 DE59.2 R26.1
NetDE51_2: DE51.2 R18.2 U19.7(OUT)
NetDE52_1: DE52.1 DE60.2 R27.1
NetDE52_2: DE52.2 R19.2 U19.8(OUT)
NetDE53_1: DE53.1 DE61.2 R28.1
NetDE53_2: DE53.2 R20.2 U20.7(OUT)
NetDE54_1: DE54.1 DE62.2 R29.1
NetDE54_2: DE54.2 R21.2 U20.8(OUT)
NetDE55_1: DE55.1 DE63.2 R30.1
NetDE55_2: DE55.2 R22.2 U21.7(OUT)
NetDE56_1: DE56.1 DE64.2 R31.1
NetDE56_2: DE56.2 R23.2 U21.8(OUT)
NetDE57_1: DE57.1 R80.2 RP1.1 U18.1(OUT) U18.2(IN-)
NetDE58_1: DE58.1 R83.2 RP5.1 U18.13(IN-) U18.14(OUT)
NetDE59_1: DE59.1 R84.2 RP2.1 U19.1(OUT) U19.2(IN-)
NetDE60_1: DE60.1 R87.2 RP6.1 U19.13(IN-) U19.14(OUT)
NetDE61_1: DE61.1 R88.2 RP3.1 U20.1(OUT) U20.2(IN-)
NetDE62_1: DE62.1 R91.2 RP7.1 U20.13(IN-) U20.14(OUT)
NetDE63_1: DE63.1 R92.2 RP4.1 U21.1(OUT) U21.2(IN-)
NetDE64_1: DE64.1 R95.2 RP8.1 U21.13(IN-) U21.14(OUT)
NetDE65_2: DE65.2 R24.2 R32.1
NetDE66_2: DE66.2 R25.2 R33.1
NetDE67_2: DE67.2 R26.2 R34.1
NetDE68_2: DE68.2 R27.2 R35.1
NetDE69_2: DE69.2 R28.2 R36.1
NetDE70_2: DE70.2 R29.2 R37.1
NetDE71_2: DE71.2 R30.2 R38.1
NetDE72_2: DE72.2 R31.2 R39.1
NetDE73_1: DE73.1 DE81.2 R56.1
NetDE73_2: DE73.2 R48.2 U22.7(OUT)
NetDE74_1: DE74.1 DE113.1 R57.1
NetDE74_2: DE74.2 R49.2 U22.8(OUT)
NetDE75_1: DE75.1 DE83.2 R58.1
NetDE75_2: DE75.2 R50.2 U23.7(OUT)
NetDE76_1: DE76.1 DE84.2 R59.1
NetDE76_2: DE76.2 R51.2 U23.8(OUT)
NetDE77_1: DE77.1 DE85.2 R60.1
NetDE77_2: DE77.2 R52.2 U24.7(OUT)
NetDE78_1: DE78.1 DE86.2 R61.1
NetDE78_2: DE78.2 R53.2 U24.8(OUT)
NetDE79_1: DE79.1 DE87.2 R62.1
NetDE79_2: DE79.2 R54.2 U25.7(OUT)
NetDE80_1: DE80.1 DE88.2 R63.1
NetDE80_2: DE80.2 R55.2 U25.8(OUT)
NetDE81_1: DE81.1 R96.2 RP9.1 U22.1(OUT) U22.2(IN-)
NetDE83_1: DE83.1 R100.2 RP10.1 U23.1(OUT) U23.2(IN-)
NetDE84_1: DE84.1 R103.2 RP14.1 U23.13(IN-) U23.14(OUT)
NetDE85_1: DE85.1 R104.2 RP11.1 U24.1(OUT) U24.2(IN-)
NetDE86_1: DE86.1 R107.2 RP15.1 U24.13(IN-) U24.14(OUT)
NetDE87_1: DE87.1 R108.2 RP12.1 U25.1(OUT) U25.2(IN-)
NetDE88_1: DE88.1 R111.2 RP16.1 U25.13(IN-) U25.14(OUT)
NetDE89_2: DE89.2 R56.2 R64.1
NetDE90_2: DE90.2 R57.2 R65.1
NetDE91_2: DE91.2 R58.2 R66.1
NetDE92_2: DE92.2 R59.2 R67.1
NetDE93_2: DE93.2 R60.2 R68.1
NetDE94_2: DE94.2 R61.2 R69.1
NetDE95_2: DE95.2 R62.2 R70.1
NetDE96_2: DE96.2 R63.2 R71.1
NetDE113_2: DE113.2 R99.2 RP13.1 U22.13(IN-) U22.14(OUT)
NetDE114_2: DE114.2 R34.2
NetDE115_1: DE115.1 R35.2
NetDE116_2: DE116.2 R36.2
NetDE117_1: DE117.1 R37.2
NetDE118_2: DE118.2 R38.2
NetDE119_1: DE119.1 R39.2
NetDE120_2: DE120.2 R64.2
NetDE121_1: DE121.1 R65.2
NetDE122_2: DE122.2 R66.2
NetDE123_1: DE123.1 R67.2
NetDE124_2: DE124.2 R68.2
NetDE125_1: DE125.1 R69.2
NetDE126_2: DE126.2 R70.2
NetDE127_1: DE127.1 R71.2
NetR2_1: R2.1 U7.1(FB)
NetR8_1: R8.1 R16.1 U18.6(IN-)
NetR9_1: R9.1 R17.1 U18.9(IN-)
NetR10_1: R10.1 R18.1 U19.6(IN-)
NetR11_1: R11.1 R19.1 U19.9(IN-)
NetR12_1: R12.1 R20.1 U20.6(IN-)
NetR13_1: R13.1 R21.1 U20.9(IN-)
NetR14_1: R14.1 R22.1 U21.6(IN-)
NetR15_1: R15.1 R23.1 U21.9(IN-)
NetR40_1: R40.1 R48.1 U22.6(IN-)
NetR41_1: R41.1 R49.1 U22.9(IN-)
NetR42_1: R42.1 R50.1 U23.6(IN-)
NetR43_1: R43.1 R51.1 U23.9(IN-)
NetR44_1: R44.1 R52.1 U24.6(IN-)
NetR45_1: R45.1 R53.1 U24.9(IN-)
NetR46_1: R46.1 R54.1 U25.6(IN-)
NetR47_1: R47.1 R55.1 U25.9(IN-)
NetR80_1: R80.1 R81.2 RP1.2 U18.5(IN+)
NetR82_2: R82.2 R83.1 RP5.2 U18.10(IN+)
NetR84_1: R84.1 R85.2 RP2.2 U19.5(IN+)
NetR86_2: R86.2 R87.1 RP6.2 U19.10(IN+)
NetR88_1: R88.1 R89.2 RP3.2 U20.5(IN+)
NetR90_2: R90.2 R91.1 RP7.2 U20.10(IN+)
NetR92_1: R92.1 R93.2 RP4.2 U21.5(IN+)
NetR94_2: R94.2 R95.1 RP8.2 U21.10(IN+)
NetR96_1: R96.1 R97.2 RP9.2 U22.5(IN+)
NetR98_2: R98.2 R99.1 RP13.2 U22.10(IN+)
NetR100_1: R100.1 R101.2 RP10.2 U23.5(IN+)
NetR102_2: R102.2 R103.1 RP14.2 U23.10(IN+)
NetR104_1: R104.1 R105.2 RP11.2 U24.5(IN+)
NetR106_2: R106.2 R107.1 RP15.2 U24.10(IN+)
NetR108_1: R108.1 R109.2 RP12.2 U25.5(IN+)
NetR110_2: R110.2 R111.1 RP16.2 U25.10(IN+)

Not connected (* = marked no-connect by the designer): J1-3 2; J4-2 10; J5-7 2; J8-6 10; U26 1(DNC) 3(TMP) 7(NC) 8(DNC)

### Notes on the sheet
- JP2,3复用 <v>
- (near J1-3) 5V <v>
- (near JP7) VCC
- (near JP7) SCL
- (near JP7) DIN(SDA)
- (near J4-2) RST <v>
- (near JP7) LED(BLK)
- (near JP7) CS(E)
- (near JP7) DC
- (near JP7) RST
- (near JP8) VCC
- RST
- (near JP10) CS(E)
- (near JP10) DC
- (near JP8) GND
- (near JP8) SCL
- (near JP8) SDA
- (near J5-7) 5V <v>
- (near JP10) DIN(SDA)
- (near JP10) SCL
- (near JP10) VCC
- (near JP10) LED(BLK)
- (near JP9) SDA
- (near JP9) SCL
- (near JP9) VCC
- (near JP9) GND
- (near J8-6) RST <v>
- DSP_Expansion_Board <v>
- 28379D <v>
- Title
- Size:
- Date:
- A4
- Number:
- Time:
- Revision:
- Sheet
- of
- File:
- (in symbol SW-1P) NO

### Library data of the parts
3V3#1 3V3#2 GND#1 GND#2 JP8 JP9 POW_in = Header 4: 4P接插件; 淘宝ID: 小糖豆的小窝窝; BOM名称: 4P接插件; 下单链接: https://item.taobao.com/item.htm?ft=t&id=613637044352
3V3#3 GND#3 GND#4 VREF = TEST: 测试点; 淘宝ID: 小糖豆的小窝窝; BOM名称: 测试点; 下单链接: https://item.taobao.com/item.htm?ft=t&id=613637044352
C1-C55 = C: 贴片电容; 淘宝ID: 小糖豆的小窝窝; BOM名称: 贴片电容; 下单链接: https://item.taobao.com/item.htm?ft=t&id=613637044352
D1 D2 = 1N4007: 整流二极管; 淘宝ID: 小糖豆的小窝窝; BOM名称: 整流二极管; 下单链接: https://item.taobao.com/item.htm?ft=t&id=613637044352
DE1-DE127 = DEBUG: 调试断点焊盘; 淘宝ID: 小糖豆的小窝窝; BOM名称: 调试断点焊盘; 下单链接: https://item.taobao.com/item.htm?ft=t&id=613637044352
GND#5-GND#15 = TEST TP: 测试环; 淘宝ID: 小糖豆的小窝窝; BOM名称: 测试环; 下单链接: https://item.taobao.com/item.htm?ft=t&id=613637044352
J1-J6 = Header 5X2: 5*2P接插件; 淘宝ID: 小糖豆的小窝窝; BOM名称: 5*2P接插件; 下单链接: https://item.taobao.com/item.htm?ft=t&id=613637044352
J1-3 J4-2 J5-7 J8-6 = Header 10X2: 10*2P接插件; 淘宝ID: 小糖豆的小窝窝; BOM名称: 10*2P接插件; 下单链接: https://item.taobao.com/item.htm?ft=t&id=613637044352
JP1-JP7 JP10-JP12 = Header 8: 8P接插件; 淘宝ID: 小糖豆的小窝窝; BOM名称: 8P接插件; 下单链接: https://item.taobao.com/item.htm?ft=t&id=613637044352
L1 L2 = L-CDRH: 功率屏蔽电感; 淘宝ID: 小糖豆的小窝窝; BOM名称: 功率屏蔽电感; 下单链接: https://item.taobao.com/item.htm?ft=t&id=613637044352
R1-R3 R8-R73 R80-R111 = R: 贴片电阻; 淘宝ID: 小糖豆的小窝窝; BOM名称: 贴片电阻; 下单链接: https://item.taobao.com/item.htm?ft=t&id=613637044352
R4-R7 R74-R79 = R-8P4R: 贴片排阻; 淘宝ID: 小糖豆的小窝窝; BOM名称: 贴片排阻; 下单链接: https://item.taobao.com/item.htm?ft=t&id=613637044352
RP1-RP16 = RP-SMD: 贴片电位器; 淘宝ID: 小糖豆的小窝窝; BOM名称: 贴片电位器; 下单链接: https://item.taobao.com/item.htm?ft=t&id=613637044352
SW1-SW8 = TSW 3x6: 3x6轻触开关; 淘宝ID: 小糖豆的小窝窝; BOM名称: 3x6轻触开关; 下单链接: https://item.taobao.com/item.htm?ft=t&id=613637044352
SW9 = SW-1P: 1路编码开关; 淘宝ID: 小糖豆的小窝窝; BOM名称: 1路编码开关; 下单链接: https://item.taobao.com/item.htm?ft=t&id=613637044352
U7 = SCT2330
U18-U25 = LM324: 4路运放; 淘宝ID: 小糖豆的小窝窝; Alias1: https://item.taobao.com/item.htm?ft=t&id=613637044352; BOM名称: 4路运放